# Altium schematic sheet Sheet1.SchDoc
size A4
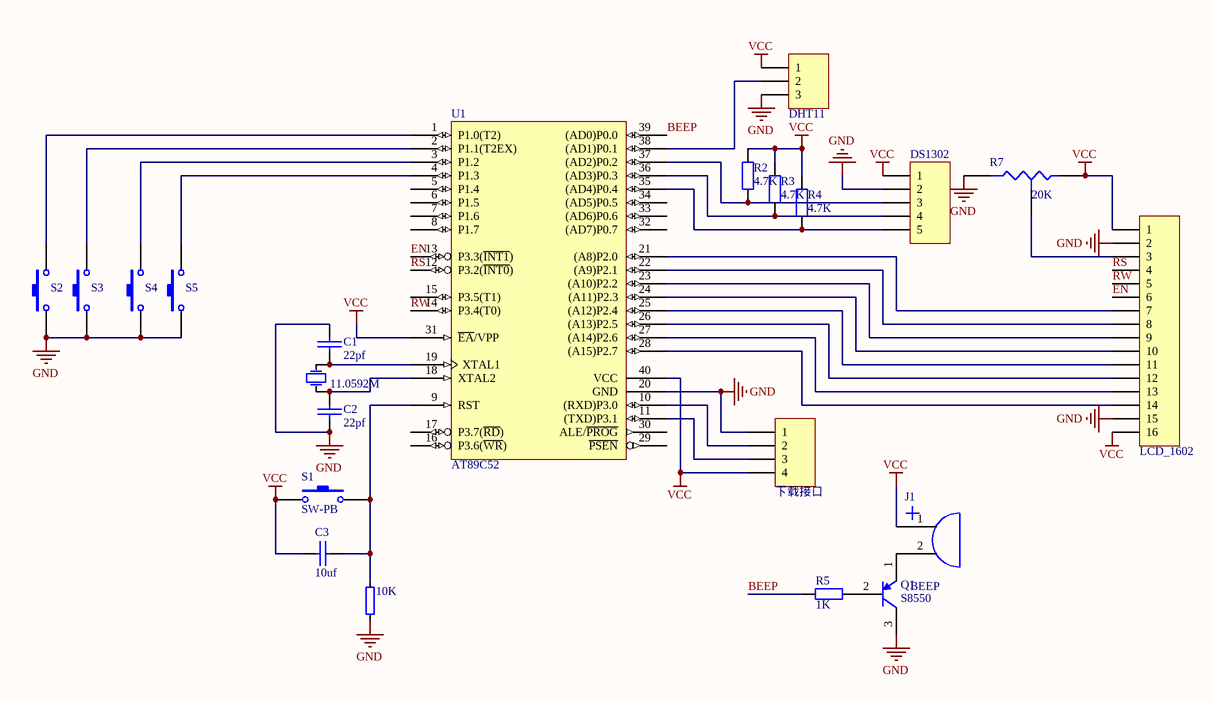
[diagram p0: Sheet1.SchDoc]

## Parts
10K  R  [0402]  (value not drawn)
C1  22pf  [0402]
C2  22pf  [0402]
C3  10uf  [0402]
DHT11  Header 3  [HDR3X1_A]  (value not drawn)
DS1302  Header 5  [HDR1X5]  (value not drawn)
J1  BEEP  [Beep]
P2  LCD_1602  [HDR1X16]
Q1  S8550  [TO-92A]
R2  value 4.7K  [AXIAL-0.4]  (hidden comment: Res2)
R3  value 4.7K  [AXIAL-0.4]  (hidden comment: Res2)
R4  value 4.7K  [AXIAL-0.4]  (hidden comment: Res2)
R5  value 1K  [AXIAL-0.4]  (hidden comment: Res2)
R7  value 20K  [VR3]  (hidden comment: Res Tap)
S1  SW-PB  [SW_PB2_A1]
S2  SW-PB  [SW_PB2_A1]  (value not drawn)
S3  SW-PB  [SW_PB2_A1]  (value not drawn)
S4  SW-PB  [SW_PB2_A1]  (value not drawn)
S5  SW-PB  [SW_PB2_A1]  (value not drawn)
U1  AT89C52  [DIP-40]
Y1  value 11.0592M  [X-HC49U]  (hidden comment: XTAL)
下载接口  Header 4  [HDR4X1_A]  (value not drawn)

## Nets
GND: 10K.1 C1.2 C2.1 DHT11.3 DS1302.2 P2.2 P2.15 Q1.3(C) R7.2(B) S2.1 S3.1 S4.1 S5.1 U1.20(GND) 下载接口.1
VCC: C3.1 DHT11.1 DS1302.1 J1.1 P2.1 P2.16 R2.2 R3.2 R4.2 R7.1(A) S1.1 U1.31(~{EA}/VPP) U1.40(VCC) 下载接口.4
BEEP: R5.2 U1.39((AD0)P0.0)
EN: P2.6 U1.13(P3.3(~{INT1}))
RS: P2.4 U1.12(P3.2(~{INT0}))
RW: P2.5 U1.14(P3.4(T0))
Net10K_2: 10K.2 C3.2 S1.2 U1.9(RST)
NetC1_1: C1.1 U1.19(XTAL1) Y1.2(OSC2)
NetC2_2: C2.2 U1.18(XTAL2) Y1.1(OSC1)
NetDHT11_2: DHT11.2 U1.38((AD1)P0.1)
NetDS1302_3: DS1302.3 R2.1 U1.37((AD2)P0.2)
NetDS1302_4: DS1302.4 R3.1 U1.36((AD3)P0.3)
NetDS1302_5: DS1302.5 R4.1 U1.35((AD4)P0.4)
NetJ1_2: J1.2 Q1.1(E)
NetP2_3: P2.3 R7.3(TAP)
NetP2_7: P2.7 U1.21((A8)P2.0)
NetP2_8: P2.8 U1.22((A9)P2.1)
NetP2_9: P2.9 U1.23((A10)P2.2)
NetP2_10: P2.10 U1.24((A11)P2.3)
NetP2_11: P2.11 U1.25((A12)P2.4)
NetP2_12: P2.12 U1.26((A13)P2.5)
NetP2_13: P2.13 U1.27((A14)P2.6)
NetP2_14: P2.14 U1.28((A15)P2.7)
NetQ1_2: Q1.2(B) R5.1
NetS2_2: S2.2 U1.1(P1.0(T2))
NetS3_2: S3.2 U1.2(P1.1(T2EX))
NetS4_2: S4.2 U1.3(P1.2)
NetS5_2: S5.2 U1.4(P1.3)
NetU1_10: U1.10((RXD)P3.0) 下载接口.2
NetU1_11: U1.11((TXD)P3.1) 下载接口.3

Not connected (* = marked no-connect by the designer): U1 5(P1.4) 6(P1.5) 7(P1.6) 8(P1.7) 15(P3.5(T1)) 16(P3.6(~{WR})) 17(P3.7(~{RD})) 29(~{PSEN}) 30(ALE/~{PROG}) 32((AD7)P0.7) 33((AD6)P0.6) 34((AD5)P0.5)

## Library data of the parts
C1-C3 = C
DHT11 = Header 3: 接插件; LatestRevisionDate: 17-Jul-2002; LatestRevisionNote: Re-released for DXP Platform.; Publisher: Altium Limited
DS1302 = Header 5: Header, 5-Pin; LatestRevisionDate: 17-Jul-2002; LatestRevisionNote: Re-released for DXP Platform.; Publisher: Altium Limited
J1 = BEEP: 蜂鸣器
P2 = Header 16: Header, 16-Pin; LatestRevisionDate: 17-Jul-2002; LatestRevisionNote: Re-released for DXP Platform.; Publisher: Altium Limited
Q1 = S8550: PNP三极管; Published: 8-Jun-2000; LatestRevisionDate: 15-Jan-2003; LatestRevisionNote: PCB Footprint 'BCY-W3/D4.7' replaced; DatasheetDocument: 1997; PackageDocument: Sep-1998; PackageReference: TO-92A; Publisher: Altium Limited; Code_JEDEC: TO-92A; ComponentLink1Description: Manufacturer Link; ComponentLink1URL: http://www.fairchildsemi.com/; ComponentLink2Description: Datasheet; ComponentLink2URL: http://www.fairchildsemi.com/ds/2N%2F2N3906.pdf
R2-R5 = Res2: Resistor; Published: 8-Jun-2000; LatestRevisionDate: 17-Jul-2002; LatestRevisionNote: Re-released for DXP Platform.; PackageReference: AXIAL-0.4; Publisher: Altium Limited; PackageDescription: Axial Device, Thru-Hole; 2 Leads; 0.4 in Pin Spacing
R7 = Res Tap: Tapped Resistor; Sim Note: Enter the Resistance value and the set point into parameter fields.; Set Position: 0.5; Published: 24-Mar-1999; LatestRevisionDate: 17-Jul-2002; LatestRevisionNote: Re-released for DXP Platform.; PackageReference: VR3; Publisher: Altium Limited; PackageDescription: Variable Resistor, Thru-Hole; 3 Leads
S1-S5 = SW-PB: 微动开关; Published: 24-Mar-1999; LatestRevisionDate: 17-Jul-2002; LatestRevisionNote: Re-released for DXP Platform.; PackageReference: SPST-2; Publisher: Altium Limited
U1 = AT89C52: 8-Bit Microcontroller with 8K Flash ROM
Y1 = XTAL: 晶振; Published: 8-Jun-2000; LatestRevisionDate: 17-Jul-2002; LatestRevisionNote: Re-released for DXP Platform.; PackageReference: R38; Publisher: Altium Limited
下载接口 = Header 4: 接插件; LatestRevisionDate: 17-Jul-2002; LatestRevisionNote: Re-released for DXP Platform.; Publisher: Altium Limited